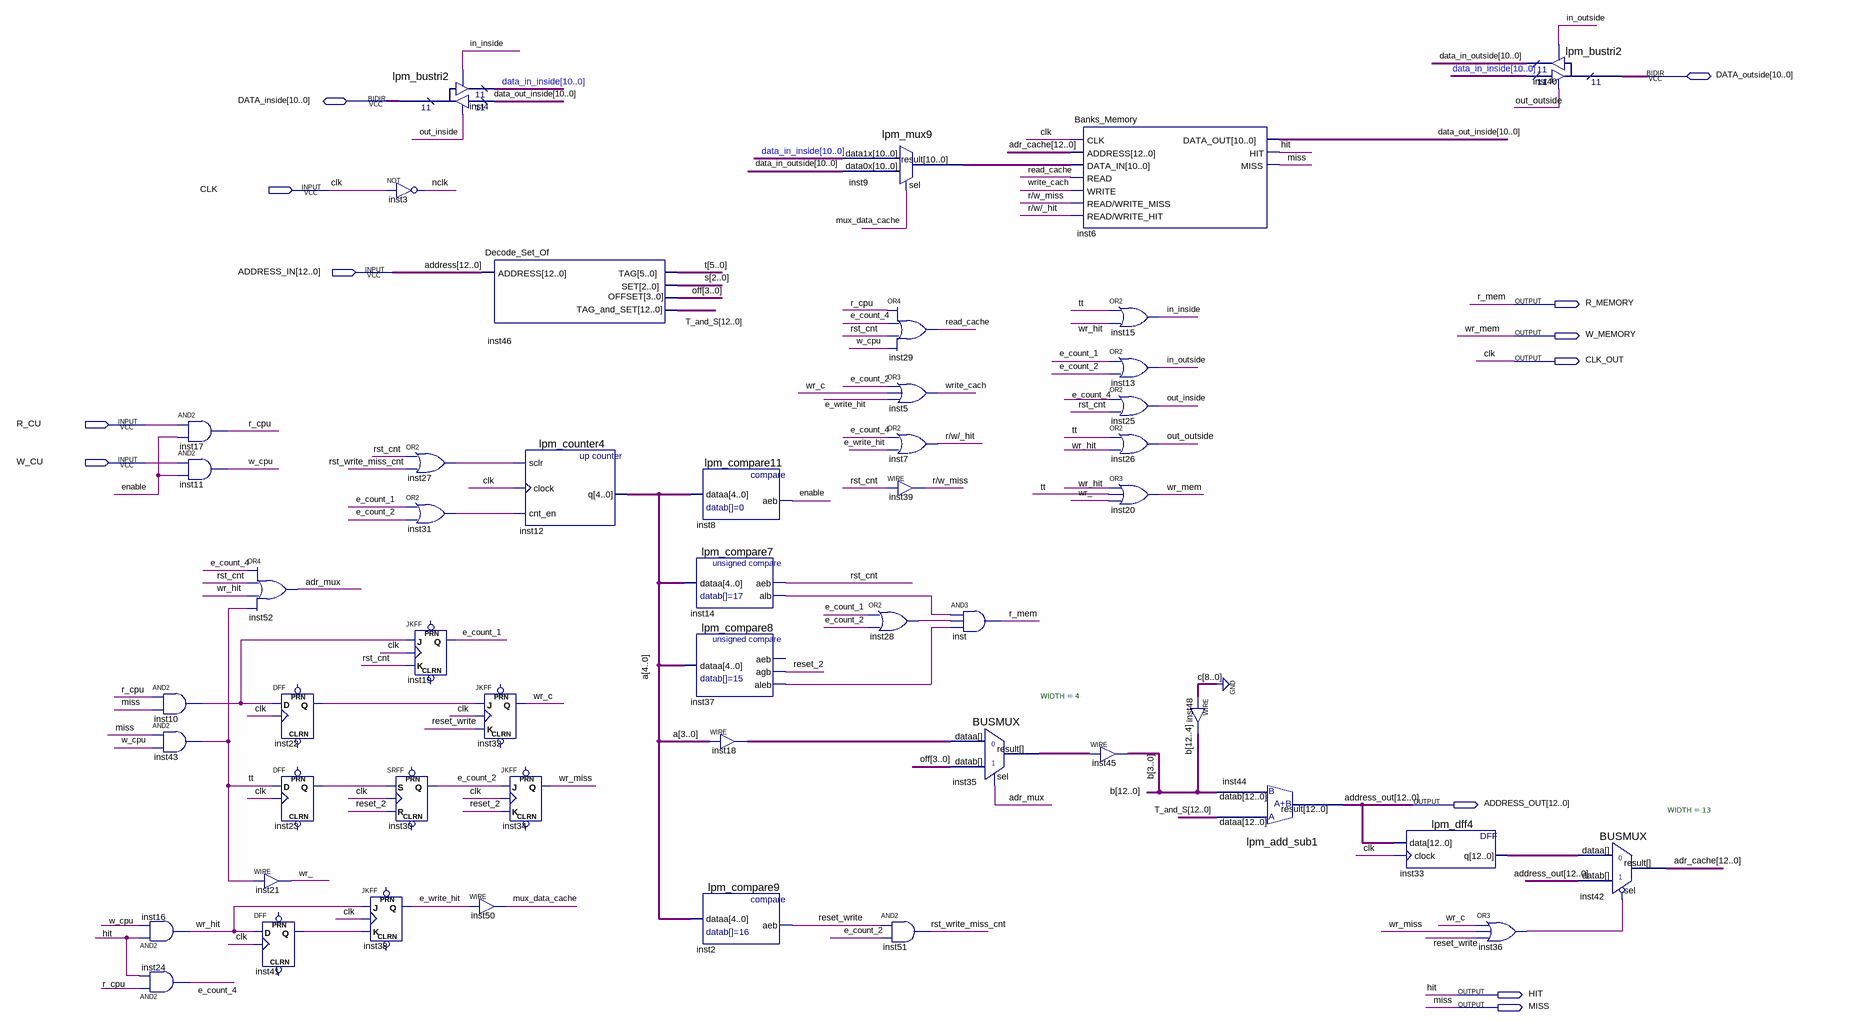
[diagram p0: schematic sheet]
// Quartus schematic CACHE.bdf as structural Verilog: 50 symbols, 12 pins
module CACHE (
  input  CLK,
  input  [12:0] ADDRESS_IN,
  input  R_CU,
  input  W_CU,
  inout  [10:0] DATA_outside,
  inout  [10:0] DATA_inside,
  output R_MEMORY,
  output W_MEMORY,
  output CLK_OUT,
  output [12:0] ADDRESS_OUT,
  output HIT,
  output MISS
);

  wire adr_mux, e_count_1, e_count_2, e_count_4, e_write_hit, enable, in_inside, in_outside, inst10_out,
       inst14_alb, inst22_q, inst23_q, inst27_out, inst28_out, inst31_out, inst36_out, inst37_aleb, inst41_q,
       mux_data_cache, nclk, out_inside, out_outside, \r/w/_hit , \r/w_miss , r_cpu, read_cache, reset_2,
       reset_write, rst_cnt, rst_write_miss_cnt, tt, w_cpu, wr_, wr_c, wr_hit, wr_miss, write_cach;
  wire [2:0] s;
  wire [3:0] inst18_out, inst35_result, off;
  wire [4:0] a;
  wire [5:0] t;
  wire [10:0] data_in_inside, data_in_outside, data_out_inside, inst9_result;
  wire [12:0] adr_cache, b, inst33_q, T_and_S;

  and inst10 (inst10_out, r_cpu, MISS);
  and inst43 (tt, MISS, w_cpu);
  and inst16 (wr_hit, HIT, w_cpu);
  and inst24 (e_count_4, r_cpu, HIT);
  and inst17 (r_cpu, R_CU, enable);
  and inst11 (w_cpu, W_CU, enable);
  or inst52 (adr_mux, e_count_4, rst_cnt, wr_hit, tt);
  assign wr_ = tt;  // WIRE inst21
  DFF inst41 (.CLK(CLK), .D(wr_hit), .Q(inst41_q));  // open: CLRN, PRN
  DFF inst22 (.CLK(CLK), .D(inst10_out), .Q(inst22_q));  // open: CLRN, PRN
  DFF inst23 (.CLK(CLK), .D(tt), .Q(inst23_q));  // open: CLRN, PRN
  JKFF inst38 (.K(inst41_q), .J(wr_hit), .CLK(CLK), .Q(e_write_hit));  // open: PRN, CLRN
  lpm_bustri2 inst4 (
    .enabledt(out_inside), .data(data_out_inside), .enabletr(in_inside), .result(data_in_inside),
    .tridata(DATA_inside));
  not inst3 (nclk, CLK);
  or inst27 (inst27_out, rst_cnt, rst_write_miss_cnt);
  or inst31 (inst31_out, e_count_1, e_count_2);
  JKFF inst19 (.K(rst_cnt), .J(inst10_out), .CLK(CLK), .Q(e_count_1));  // open: PRN, CLRN
  SRFF inst30 (.S(inst23_q), .R(reset_2), .CLK(CLK), .Q(e_count_2));  // open: PRN, CLRN
  Decode_Set_Of inst46 (.ADDRESS(ADDRESS_IN), .TAG(t), .SET(s), .OFFSET(off), .TAG_and_SET(T_and_S));
  lpm_counter4 inst12 (.sclr(inst27_out), .clock(CLK), .cnt_en(inst31_out), .q(a));
  JKFF inst32 (.K(reset_write), .J(inst22_q), .CLK(CLK), .Q(wr_c));  // open: PRN, CLRN
  JKFF inst34 (.K(reset_2), .J(e_count_2), .CLK(CLK), .Q(wr_miss));  // open: PRN, CLRN
  assign mux_data_cache = e_write_hit;  // WIRE inst50
  lpm_compare11 inst8 (.dataa(a), .aeb(enable));
  lpm_compare7 inst14 (.dataa(a), .aeb(rst_cnt), .alb(inst14_alb));
  lpm_compare8 inst37 (.dataa(a), .agb(reset_2), .aleb(inst37_aleb));  // open: aeb
  assign inst18_out = a[3:0];  // WIRE inst18
  lpm_compare9 inst2 (.dataa(a), .aeb(reset_write));
  lpm_mux9 inst9 (.data1x(data_in_inside), .data0x(data_in_outside), .sel(mux_data_cache), .result(inst9_result));
  or inst28 (inst28_out, e_count_1, e_count_2);
  or inst29 (read_cache, r_cpu, e_count_4, rst_cnt, w_cpu);
  or inst5 (write_cach, e_count_2, wr_c, e_write_hit);
  or inst7 (\r/w/_hit , e_count_4, e_write_hit);
  assign \r/w_miss  = rst_cnt;  // WIRE inst39
  and inst51 (rst_write_miss_cnt, reset_write, e_count_2);
  and inst (R_MEMORY, inst14_alb, inst28_out, inst37_aleb);
  BUSMUX #(.WIDTH(4)) inst35 (.datab(off), .sel(adr_mux), .dataa(inst18_out), .result(inst35_result));
  Banks_Memory inst6 (
    .CLK(CLK), .ADDRESS(adr_cache), .DATA_IN(inst9_result), .READ(read_cache), .WRITE(write_cach),
    .\READ/WRITE_MISS (\r/w_miss ), .\READ/WRITE_HIT (\r/w/_hit ), .DATA_OUT(data_out_inside), .HIT(HIT),
    .MISS(MISS));
  or inst15 (in_inside, tt, wr_hit);
  or inst13 (in_outside, e_count_1, e_count_2);
  or inst25 (out_inside, e_count_4, rst_cnt);
  or inst26 (out_outside, tt, wr_hit);
  or inst20 (W_MEMORY, wr_hit, tt, wr_);
  assign b[3:0] = inst35_result;  // WIRE inst45
  assign b[12:4] = {9{1'b0}};  // WIRE inst48
  lpm_add_sub1 inst44 (.dataa(T_and_S), .datab(b), .result(ADDRESS_OUT));
  lpm_dff4 inst33 (.data(ADDRESS_OUT), .clock(CLK), .q(inst33_q));
  or inst36 (inst36_out, wr_c, wr_miss, reset_write);
  lpm_bustri2 inst40 (
    .enabledt(out_outside), .data(data_in_inside), .enabletr(in_outside), .result(data_in_outside),
    .tridata(DATA_outside));
  BUSMUX #(.WIDTH(13)) inst42 (.datab(ADDRESS_OUT), .sel(~inst36_out), .dataa(inst33_q), .result(adr_cache));

  assign CLK_OUT = CLK;

  // Other names for the same wires on the sheet: address[12:0] = ADDRESS_IN; r_mem = R_MEMORY; wr_mem = W_MEMORY
endmodule
